# EAGLE design programming-adapter (EAGLE 7.3.0)
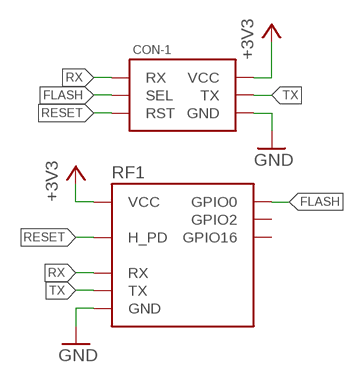
[diagram p0: schematic, sheet 1]

## Parts
CON-1  ESP8266-6_PIN-STD  [PINHEADER-100-MIL-2X6-ISP]
RF1  ESP2866-ESP-01THT-NOSILK  [ESP8266-ESP-01-NOSILK]

## Nets
+3V3: CON-1.P$6(VCC) RF1.VCC
FLASH: CON-1.P$2(SEL) RF1.GPIO0
GND: CON-1.P$4(GND) RF1.GND
RESET: CON-1.P$3(RST) RF1.H_PD
RX: CON-1.P$1(RX) RF1.RX
TX: CON-1.P$5(TX) RF1.TX
Unconnected: RF1.GPIO2 RF1.GPIO16

## Library data of the parts
CON-1 = p.peter-connectors:ESP8266-6_PIN
RF1 = p.peter-periphery:ESP2866-ESP-01

## Board
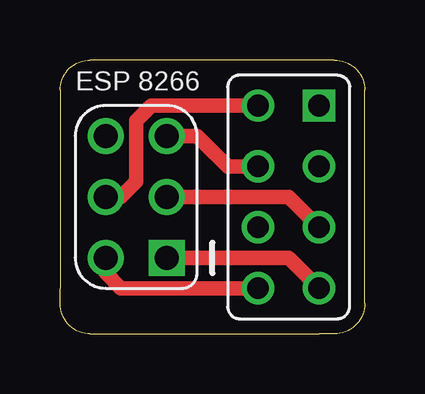
[diagram p1: board, top side]
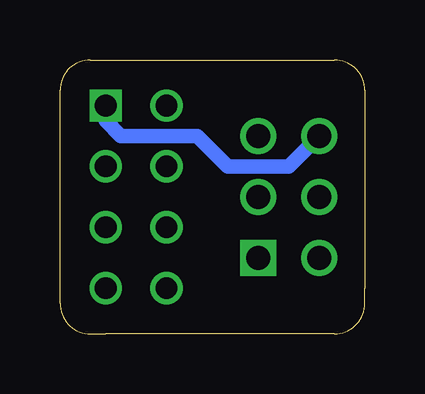
[diagram p2: board, bottom side, seen from below]

Size 12.7 x 11.43 mm. Coordinates in mm from the lower left corner, seen from the top.
Outline: 1.27,0 10.79,0 11.43,0 arc90 12.7,1.27 12.7,10.16 arc90 11.43,11.43 1.27,11.43 arc90 0,10.16 0,1.91 0,1.27 arc90 1.27,0
Copper layers (1*16): Top 0.0356mm / dielectric 1.5011mm / Bottom 0.0356mm
Design rules "oshpark": minimum track width 6mil, minimum drill 13mil, track to track 6mil, track to pad 6mil, pad to pad 6mil, via to via 6mil, smd to smd 6mil, copper to edge 15mil, drill to drill 6mil, minimum pad ring 7mil, minimum via ring 7mil, stop-mask expansion 4mil, vias tented up to drill 4.1mm, thermal gap 10mil

### Footprints (pad centres in the part's own frame; a part is rotated, then mirrored left to right if it is on the bottom)
PINHEADER-100-MIL-2X6-ISP = drill 1 square: P$1 -2.54,-1.27 | drill 1: P$2 0,-1.27; P$3 2.54,-1.27; P$4 2.54,1.27; P$5 0,1.27; P$6 -2.54,1.27
ESP8266-ESP-01-NOSILK = drill 0.9 square: GND 1.27,3.81 | drill 0.9: GPIO0 1.27,-1.27; GPIO2 1.27,1.27; GPIO16 -1.27,-1.27; H_PD -1.27,1.27; RX 1.27,-3.81; TX -1.27,3.81; VCC -1.27,-3.81

### Placement (x,y rotation side)
CON-1  3.17,5.71 90 top
RF1  9.53,5.71 0 top

### Tracks (layer width: path | path; a pad name or v marks a point on that pad's centre or on a via)
+3V3
  Top 0.61: CON-1.P$6 1.91,2.54 2.54,1.91 RF1.VCC
FLASH
  Top 0.61: CON-1.P$2 9.53,5.71 RF1.GPIO0
GND
  Bottom 0.61: CON-1.P$4 3.17,6.99 5.71,6.99 6.35,7.62 6.99,8.26 10.16,8.26 10.79,8.89 RF1.GND
RESET
  Top 0.61: CON-1.P$3 5.71,8.26 6.99,6.99 RF1.H_PD
RX
  Top 0.61: CON-1.P$1 9.53,3.17 RF1.RX
TX
  Top 0.61: RF1.TX 3.81,9.53 3.17,8.89 3.17,6.35 2.54,5.71 CON-1.P$5

### Text on the board
tPlace: ESP 8266